# Altium schematic sheet OZ440-SE100-CAR002-SCH01_logique - Copie.SchDoc: Carte Driver Moteur sur Bus CAN
size A3; Date: 08/04/14; CheckedBy: GS; Author: BM; DocumentNumber: OZ440-SE100-CAR001-SCH01; Revision: A; SheetNumber: 1; SheetTotal: 2
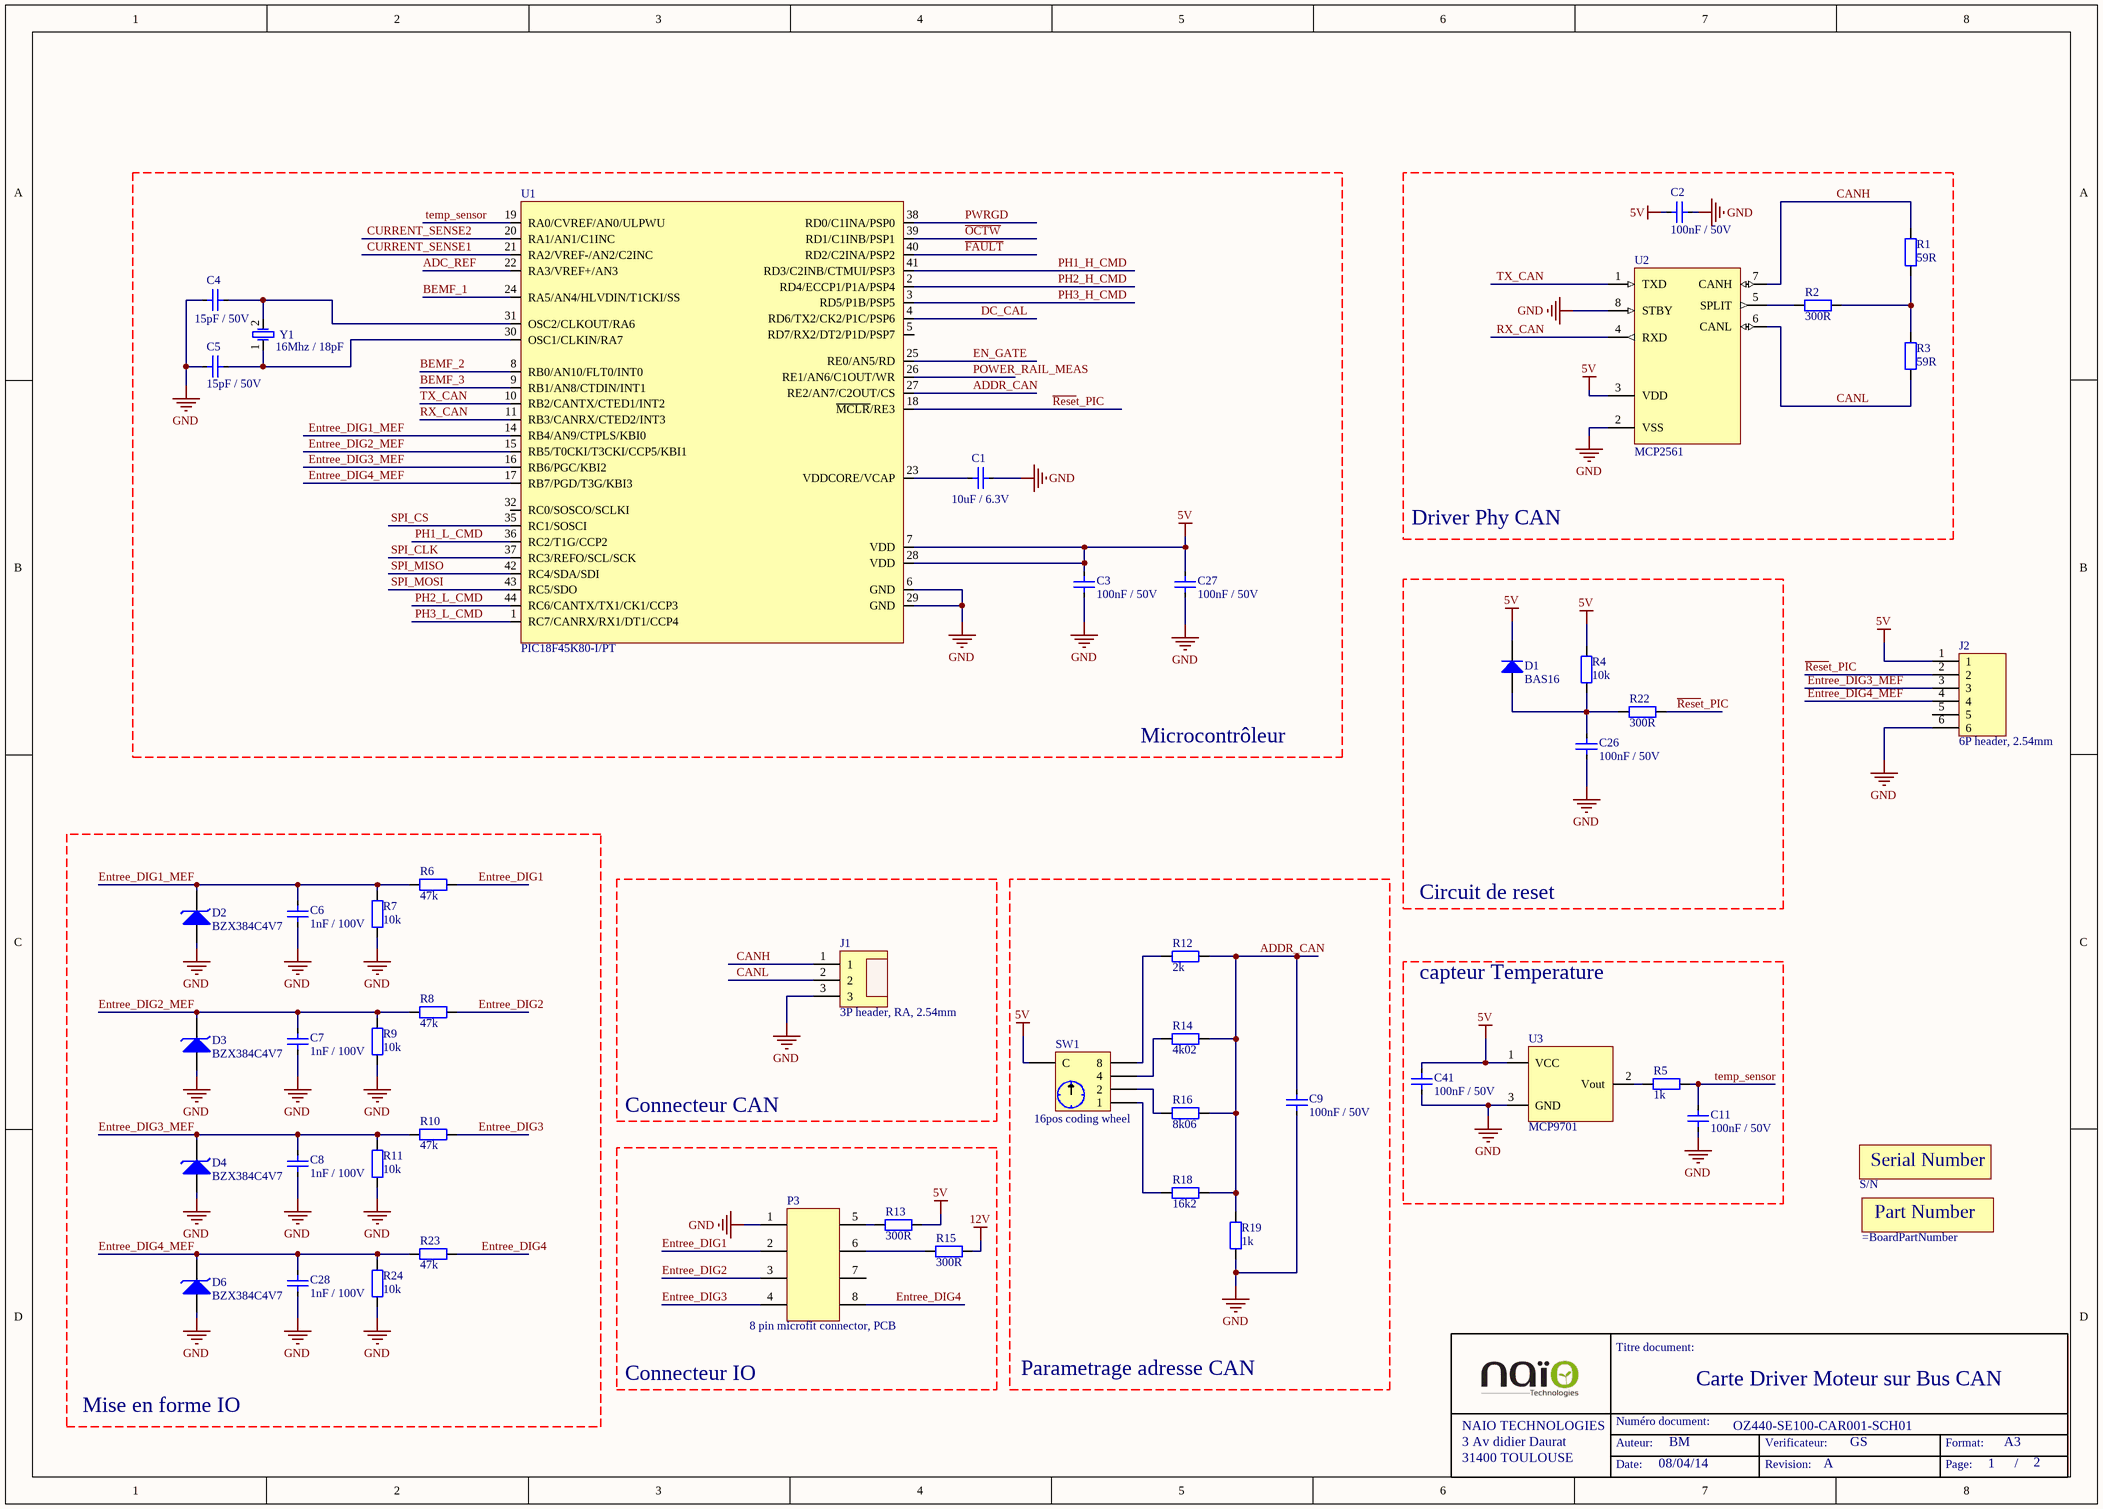
[diagram p0: OZ440-SE100-CAR002-SCH01_logique - Copie.SchDoc]

## Parts
C1  Displayed reference: 10uF / 6.3V  [C0805-STD]  (hidden comment: CAP-SMD)
C2  Displayed reference: 100nF / 50V  [C0805-STD]  (hidden comment: CAP-SMD)
C3  Displayed reference: 100nF / 50V  [C0805-STD]  (hidden comment: CAP-SMD)
C4  Displayed reference: 15pF / 50V  [C0805-STD]  (hidden comment: CAP-SMD)
C5  Displayed reference: 15pF / 50V  [C0805-STD]  (hidden comment: CAP-SMD)
C6  Displayed reference: 1nF / 100V  [C0805-STD]  (hidden comment: CAP-SMD)
C7  Displayed reference: 1nF / 100V  [C0805-STD]  (hidden comment: CAP-SMD)
C8  Displayed reference: 1nF / 100V  [C0805-STD]  (hidden comment: CAP-SMD)
C9  Displayed reference: 100nF / 50V  [C0805-STD]  (hidden comment: CAP-SMD)
C11  Displayed reference: 100nF / 50V  [C0805-STD]  (hidden comment: CAP-SMD)
C26  Displayed reference: 100nF / 50V  [C0805-STD]  (hidden comment: CAP-SMD)
C27  Displayed reference: 100nF / 50V  [C0805-STD]  (hidden comment: CAP-SMD)
C28  Displayed reference: 1nF / 100V  [C0805-STD]  (hidden comment: CAP-SMD)
C41  Displayed reference: 100nF / 50V  [C0805-STD]  (hidden comment: CAP-SMD)
D1  Displayed reference: BAS16  [SOT23-STD]  (hidden comment: BAS16-SOT23)
D2  Displayed reference: BZX384C4V7  [SOD323-SPE-BZX384]  (hidden comment: DIODE_ZENER-SOD323)
D3  Displayed reference: BZX384C4V7  [SOD323-SPE-BZX384]  (hidden comment: DIODE_ZENER-SOD323)
D4  Displayed reference: BZX384C4V7  [SOD323-SPE-BZX384]  (hidden comment: DIODE_ZENER-SOD323)
D6  Displayed reference: BZX384C4V7  [SOD323-SPE-BZX384]  (hidden comment: DIODE_ZENER-SOD323)
J1  Displayed reference: 3P header, RA, 2.54mm  [CONN-SPE_MOLEX_0015913033]  (hidden comment: CONN-STD-3P_1ROW)
J2  Displayed reference: 6P header, 2.54mm  [6P_HEADER-STD_TH_1ROW]  (hidden comment: CONN-STD-6P_1ROW)
P3  Displayed reference: 8 pin microfit connector, PCB  [CONN-SPE_MOLEX_43045-0801]  (hidden comment: CONN-SPE-8P_MOLEX_43045-0801)
PN1  PART-NUMBER  [PART_NUMBER-STD]  (value not drawn)
R1  Displayed reference: 59R  [R0805-STD]  (hidden comment: RES-SMD)
R2  Displayed reference: 300R  [R0805-STD]  (hidden comment: RES-SMD)
R3  Displayed reference: 59R  [R0805-STD]  (hidden comment: RES-SMD)
R4  Displayed reference: 10k  [R0805-STD]  (hidden comment: RES-SMD)
R5  Displayed reference: 1k  [R0805-STD]  (hidden comment: RES-SMD)
R6  Displayed reference: 47k  [R0805-STD]  (hidden comment: RES-SMD)
R7  Displayed reference: 10k  [R0805-STD]  (hidden comment: RES-SMD)
R8  Displayed reference: 47k  [R0805-STD]  (hidden comment: RES-SMD)
R9  Displayed reference: 10k  [R0805-STD]  (hidden comment: RES-SMD)
R10  Displayed reference: 47k  [R0805-STD]  (hidden comment: RES-SMD)
R11  Displayed reference: 10k  [R0805-STD]  (hidden comment: RES-SMD)
R12  Displayed reference: 2k  [R0805-STD]  (hidden comment: RES-SMD)
R13  Displayed reference: 300R  [R0805-STD]  (hidden comment: RES-SMD)
R14  Displayed reference: 4k02  [R0805-STD]  (hidden comment: RES-SMD)
R15  Displayed reference: 300R  [R0805-STD]  (hidden comment: RES-SMD)
R16  Displayed reference: 8k06  [R0805-STD]  (hidden comment: RES-SMD)
R18  Displayed reference: 16k2  [R0805-STD]  (hidden comment: RES-SMD)
R19  Displayed reference: 1k  [R0805-STD]  (hidden comment: RES-SMD)
R22  Displayed reference: 300R  [R0805-STD]  (hidden comment: RES-SMD)
R23  Displayed reference: 47k  [R0805-STD]  (hidden comment: RES-SMD)
R24  Displayed reference: 10k  [R0805-STD]  (hidden comment: RES-SMD)
SN1  Displayed reference: S/N  [SERIAL_NUMBER-STD]  (hidden comment: SERIAL-NUMBER)
SW1  Displayed reference: 16pos coding wheel  [SW-SPE-CTS_220-AMA16]  (hidden comment: Switch-STD-coding_wheel)
U1  Displayed reference: PIC18F45K80-I/PT  [TQFP44-SPE-PIC18F45k80]  (hidden comment: P18F45K80-TQFP44)
U2  Displayed reference: MCP2561  [SO8-SPE-MCP2561]  (hidden comment: MCP2561-SOIC08)
U3  Displayed reference: MCP9701  [SOT23-STD]  (hidden comment: MCP97XX-SOT23)
Y1  Displayed reference: 16Mhz / 18pF  [XTAL-SPE-HC49_SMD]  (hidden comment: XTAL-SMD)

## Nets
5V: C2.2 C3.2 C27.2 C41.2 D1.3(K) J2.1 R4.2 R13.2 SW1.C U1.7(VDD) U1.28(VDD) U2.3(VDD) U3.1(VCC)
12V: R15.2
GND: C1.2 C2.1 C3.1 C4.1 C5.1 C6.1 C7.1 C8.1 C9.1 C11.1 C26.1 C27.1 C28.1 C41.1 D2.A D3.A D4.A D6.A J1.3 J2.6 P3.1 R7.1 R9.1 R11.1 R19.1 R24.1 U1.6(GND) U1.29(GND) U2.2(VSS) U2.8(STBY) U3.3(GND)
~{FAULT}: U1.40(RD2/C2INA/PSP2)
~{OCTW}: U1.39(RD1/C1INB/PSP1)
~{Rese}t_PIC: J2.2 R22.2 U1.18(~{MCLR}/RE3)
ADC_REF: U1.22(RA3/VREF+/AN3)
ADDR_CAN: C9.2 R12.2 R14.2 R16.2 R18.2 R19.2 U1.27(RE2/AN7/C2OUT/CS)
BEMF_1: U1.24(RA5/AN4/HLVDIN/T1CKI/SS)
BEMF_2: U1.8(RB0/AN10/FLT0/INT0)
BEMF_3: U1.9(RB1/AN8/CTDIN/INT1)
CANH: J1.1 R1.2 U2.7(CANH)
CANL: J1.2 R3.1 U2.6(CANL)
CURRENT_SENSE1: U1.21(RA2/VREF-/AN2/C2INC)
CURRENT_SENSE2: U1.20(RA1/AN1/C1INC)
DC_CAL: U1.4(RD6/TX2/CK2/P1C/PSP6)
EN_GATE: U1.25(RE0/AN5/RD)
Entree_DIG1: P3.2 R6.1
Entree_DIG1_MEF: C6.2 D2.K R6.2 R7.2 U1.14(RB4/AN9/CTPLS/KBI0)
Entree_DIG2: P3.3 R8.1
Entree_DIG2_MEF: C7.2 D3.K R8.2 R9.2 U1.15(RB5/T0CKI/T3CKI/CCP5/KBI1)
Entree_DIG3: P3.4 R10.1
Entree_DIG3_MEF: C8.2 D4.K J2.3 R10.2 R11.2 U1.16(RB6/PGC/KBI2)
Entree_DIG4: P3.8 R23.1
Entree_DIG4_MEF: C28.2 D6.K J2.4 R23.2 R24.2 U1.17(RB7/PGD/T3G/KBI3)
PH1_H_CMD: U1.41(RD3/C2INB/CTMUI/PSP3)
PH1_L_CMD: U1.36(RC2/T1G/CCP2)
PH2_H_CMD: U1.2(RD4/ECCP1/P1A/PSP4)
PH2_L_CMD: U1.44(RC6/CANTX/TX1/CK1/CCP3)
PH3_H_CMD: U1.3(RD5/P1B/PSP5)
PH3_L_CMD: U1.1(RC7/CANRX/RX1/DT1/CCP4)
POWER_RAIL_MEAS: U1.26(RE1/AN6/C1OUT/WR)
PWRGD: U1.38(RD0/C1INA/PSP0)
RX_CAN: U1.11(RB3/CANRX/CTED2/INT3) U2.4(RXD)
SPI_CLK: U1.37(RC3/REFO/SCL/SCK)
SPI_CS: U1.35(RC1/SOSCI)
SPI_MISO: U1.42(RC4/SDA/SDI)
SPI_MOSI: U1.43(RC5/SDO)
temp_sensor: C11.2 R5.2 U1.19(RA0/CVREF/AN0/ULPWU)
TX_CAN: U1.10(RB2/CANTX/CTED1/INT2) U2.1(TXD)
NetC1_1: C1.1 U1.23(VDDCORE/VCAP)
NetC4_2: C4.2 U1.31(OSC2/CLKOUT/RA6) Y1.2(OSC2)
NetC5_2: C5.2 U1.30(OSC1/CLKIN/RA7) Y1.1(OSC1)
NetC26_2: C26.2 D1.1(A) R4.1 R22.1
NetP3_5: P3.5 R13.1
NetP3_6: P3.6 R15.1
NetR1_1: R1.1 R2.2 R3.2
NetR2_1: R2.1 U2.5(SPLIT)
NetR5_1: R5.1 U3.2(Vout)
NetR12_1: R12.1 SW1.8
NetR14_1: R14.1 SW1.4
NetR16_1: R16.1 SW1.2
NetR18_1: R18.1 SW1.1

Not connected (* = marked no-connect by the designer): J2 5; P3 7; U1 5(RD7/RX2/DT2/P1D/PSP7) 32(RC0/SOSCO/SCLKI)

## Notes on the sheet
- Driver Phy CAN
- Microcontrôleur
- Circuit de reset
- capteur Temperature
- Connecteur CAN
- Connecteur IO
- Parametrage adresse CAN
- Mise en forme IO
- Titre document:
- NAIO TECHNOLOGIES
- 3 Av didier Daurat
- 31400 TOULOUSE
- Auteur:
- Numéro document:
- Verificateur:
- Format:
- A3
- Date:
- Revision:
- Page:
- /
- (in symbol Large part number) Part Number

## Library data of the parts
C1 = C0805C106K9PACxx: 0805 10uF / 6.3V X5R ceramic capacitor; Manufacturer: Kemet; Max Voltage: 6.3; Tolerance: +/- 10%; Validated: N; Reference: C0805C106K9PACxx; Value: 10uF; Material: X5R; Footprint description: standard Capacitor 0805; Pin Count: 2; helpURL: http://www.farnell.com/datasheets/40863.pdf; Supplier 1: Farnell; Supplier Part Number 1: 1643357; Supplier 2: Digi-Key; Supplier Part Number 2: 399-3138-1-ND
C2 C3 C9 C11 C26 C27 C41 = VJ0805Y104KXAxx: 0805 100nF / 50V  X7R ceramic capacitor; Manufacturer: vishay; Max Voltage: 50; Tolerance: +/- 10%; Validated: N; Reference: VJ0805Y104KXAxx; Value: 100nF; Material: X7R; Footprint description: standard Capacitor 0805; Pin Count: 2; helpURL: http://www.vishay.com/docs/45200/highrels.pdf; Supplier 1: Farnell; Supplier Part Number 1: 1612208; Supplier 2: Digi-Key; Supplier Part Number 2: 720-1266-6-ND
C4 C5 = C0805C150J5GACxx: 0805 15pF / 50V COG ceramic capacitor; Manufacturer: Kemet; Max Voltage: 50; Tolerance: +/- 5%; Validated: N; Reference: C0805C150J5GACxx; Value: 15pF; Material: COG; Footprint description: standard Capacitor 0805; Pin Count: 2; helpURL: http://www.farnell.com/datasheets/40863.pdf; Supplier 1: Farnell; Supplier Part Number 1: 1650868; Supplier 2: Digi-Key; Supplier Part Number 2: 399-1111-1-ND
C6-C8 C28 = VJ0805Y102KXBxx: 0805 1nF / 100V X7R ceramic capacitor; Manufacturer: vishay; Max Voltage: 50; Tolerance: +/- 10%; Validated: N; Reference: VJ0805Y102KXBxx; Value: 1nF; Material: X7R; Footprint description: standard Capacitor 0805; Pin Count: 2; helpURL: http://www.vishay.com/docs/45200/highrels.pdf; Supplier 1: Farnell; Supplier Part Number 1: 1555112; Supplier 2: Digi-Key; Supplier Part Number 2: 720-1264-1-ND
D1 = BAS16: 100V / 120mA signal  diode; Manufacturer: NXP; Max Voltage: 100; Max Current: 0.2A; Validated: False; Reference: BAS16; component type: DIODE; Footprint description: Sot23 SMD package; Pin Count: 3; Rev: 2010; helpURL: http://www.nxp.com/documents/data_sheet/BAS16_SER.pdf; Supplier 1: Farnell; Supplier Part Number 1: 1081180; Supplier 2: Digi-Key; Supplier Part Number 2: 568-1596-1-ND
D2-D4 D6 = BZX384C4V7: 4.7V zener diode; Manufacturer: VISHAY; Rated Power: 200mW; Validated: FALSE; Reference: BZX384C4V7; component type: Zener diode; Value: 4.7V; Footprint description: SOD323; Pin Count: 2; Rev: 1.9; helpURL: http://www.vishay.com/docs/85764/bzx384.pdf; Supplier 1: Mouser; Supplier Part Number 1: 771-BZX384-C4V7115; Supplier 2: Farnell; Supplier Part Number 2: 8735700
J1 = 0015913033: 3 pin , 2.54mm SMD header; Manufacturer: Molex; Validated: False; Reference: 0015913033; Footprint description: 3P header, RA, 2.54mm; Pin Count: 3; Rev: G; helpURL: http://www.molex.com/pdm_docs/sd/015913033_sd.pdf; Supplier 1: Mouser; Supplier Part Number 1: 538-15-91-3033; Supplier 2: Digi-Key; Supplier Part Number 2: 0015913033-ND
J2 = 68000-406HLF: 6P, 1 row, 2.54mm header; Manufacturer: FCI; Validated: False; Reference: 68000-406HLF; Footprint description: TH, 6 pin, 2.54mm; Pin Count: 6; Rev: DB; helpURL: http://portal.fciconnect.com/Comergent//fci/drawing/68000.pdf
P3 = 43045-0801: 8 pin Microfit connector; Manufacturer: Molex; Max Voltage: 600V; Max Current: 5A; Validated: False; Reference: 43045-0801; Footprint description: 8 pin SMT connector RA, TH; Pin Count: 8; Rev: F; helpURL: http://www.molex.com/pdm_docs/sd/430450801_sd.pdf; Supplier 1: Mouser; Supplier Part Number 1: 538-43045-0801; Supplier 2: Digi-Key; Supplier Part Number 2: WM3253-ND
PN1 = Large part number: large part number copper identification; Validated: False; Reference: Large part number; Displayed reference: =BoardPartNumber
R1 R3 = CRCW080559R0FKxx: 59 Ohm 0805 SMD resistor; Manufacturer: Vishay; Value: 59; Tolerance: 1 %; Rated Power: 0.125 W; Validated: No; Reference: CRCW080559R0FKxx; Footprint description: standard 0805 SMD; Pin Count: 2; helpURL: http://www.vishay.com/docs/20035/dcrcwe3.pdf; Supplier 1: Mouser; Supplier Part Number 1: 71-CRCW080559R0FKEA; Supplier 2: Farnell; Supplier Part Number 2: 2138817
R2 R13 R15 R22 = CRCW0805300RFKxx: 300 ohm 0805 SMD resistor; Manufacturer: Vishay; Value: 300; Tolerance: 1%; Rated Power: 0.125W; Validated: No; Reference: CRCW0805300RFKxx; Footprint description: standard 0805 SMD; Pin Count: 2; helpURL: http://www.vishay.com/docs/20035/dcrcwe3.pdf; Supplier 1: Mouser; Supplier Part Number 1: 71-CRCW0805300RFKEA; Supplier 2: Farnell; Supplier Part Number 2: 1152346
R4 R7 R9 R11 R24 = CRCW080510K0FKxx: 10k Ohm 0805 SMD resistor; Manufacturer: Vishay; Value: 10 000; Tolerance: 1 %; Rated Power: 0,125 W; Validated: No; Reference: CRCW080510K0FKxx; Footprint description: standard 0805 SMD; Pin Count: 2; helpURL: http://www.vishay.com/docs/20035/dcrcwe3.pdf; Supplier 1: Farnell; Supplier Part Number 1: 1469856; Supplier 2: Mouser; Supplier Part Number 2: 71-CRCW0805-10K-E3
R5 R19 = CRCW08051K00FKxx: 1k Ohm 0805 SMD resistor; Manufacturer: Vishay; Value: 1 000; Tolerance: 1 %; Rated Power: 0,125 W; Validated: No; Reference: CRCW08051K00FKxx; Footprint description: standard 0805 SMD; Pin Count: 2; helpURL: http://www.vishay.com/docs/20035/dcrcwe3.pdf; Supplier 1: Farnell; Supplier Part Number 1: 1469847; Supplier 2: Mouser; Supplier Part Number 2: 71-CRCW0805-1.0K-E3
R6 R8 R10 R23 = CRCW080547K0FKxx: 47k Ohm 0805 SMD resistor; Manufacturer: Vishay; Value: 47 000; Tolerance: 1 %; Rated Power: 0,125 W; Validated: No; Reference: CRCW080547K0FKxx; Footprint description: standard 0805 SMD; Pin Count: 2; helpURL: http://www.vishay.com/docs/20035/dcrcwe3.pdf; Supplier 1: Farnell; Supplier Part Number 1: 1469929; Supplier 2: Mouser; Supplier Part Number 2: 71-CRCW0805-47K-E3
R12 = CRCW08052K00FKxx: 2k Ohm 0805 SMD resistor; Manufacturer: Vishay; Value: 2 000; Tolerance: 1%; Rated Power: 0.125W; Validated: No; Reference: CRCW08052K00FKxx; Footprint description: standard 0805 SMD; Pin Count: 2; helpURL: http://www.vishay.com/docs/20035/dcrcwe3.pdf; Supplier 1: Mouser; Supplier Part Number 1: 71-CRCW08052K00FKEB; Supplier 2: Farnell; Supplier Part Number 2: 1469884
R14 = CRCW08054K02FKxx: 4k02 Ohm 0805 SMD resistor; Manufacturer: Vishay; Value: 4 020; Tolerance: 1%; Rated Power: 0.125W; Validated: No; Reference: CRCW08054K02FKxx; Footprint description: standard 0805 SMD; Pin Count: 2; helpURL: http://www.vishay.com/docs/20035/dcrcwe3.pdf; Supplier 1: Farnell; Supplier Part Number 1: 1469920; Supplier 2: Mouser; Supplier Part Number 2: 71-CRCW0805-4.02K-E3
R16 = CRCW08058K06FKxx: 8k06 Ohm 0805 SMD resistor; Manufacturer: Vishay; Value: 8 060; Tolerance: 1%; Rated Power: 0.125W; Validated: No; Reference: CRCW08058K06FKxx; Footprint description: standard 0805 SMD; Pin Count: 2; helpURL: http://www.vishay.com/docs/20035/dcrcwe3.pdf; Supplier 1: Farnell; Supplier Part Number 1: 1653038; Supplier 2: Mouser; Supplier Part Number 2: 71-CRCW0805-8.06K-E3
R18 = CRCW080516K2FKxx: 16k2 Ohm 0805 SMD resistor; Manufacturer: Vishay; Value: 16200; Tolerance: 1%; Rated Power: 0.125W; Validated: No; Reference: CRCW080516K2FKxx; Footprint description: standard 0805 SMD; Pin Count: 2; helpURL: http://www.vishay.com/docs/20035/dcrcwe3.pdf; Supplier 1: Mouser; Supplier Part Number 1: 71-CRCW0805-16.2K-E3; Supplier 2: Farnell; Supplier Part Number 2: 1469878
SN1 = Serial Number: serial number copper identification; Validated: False; Reference: Serial Number
SW1 = 220AMA16x: 16 positions rotary dip switch; Manufacturer: CTS; Validated: False; Reference: 220AMA16x; Footprint description: 10x10mm SMD; Pin Count: 6; Rev: 20/02/14; helpURL: http://www.ctscorp.com/components/Datasheets/220.pdf; Supplier 1: Mouser; Supplier Part Number 1: 774-220AMA16R; Supplier 2: Digi-Key; Supplier Part Number 2: CT3072-6-ND
U1 = PIC18F45K80-I/PT: Pic microcontroller with embeded CAN controller; Manufacturer: MICROCHIP; Validated: False; Reference: PIC18F45K80-I/PT; Footprint description: standard TQFP 44 pin; Pin Count: 44; Rev: F; helpURL: http://ww1.microchip.com/downloads/en/DeviceDoc/39977f.pdf; Supplier 1: Farnell; Supplier Part Number 1: 1823169; Supplier 2: Mouser; Supplier Part Number 2: 579-PIC18F45K80-I/PT
U2 = MCP2561-E/SN: CAN transceiver with common mode stabilisation; Manufacturer: Microchip; Max Voltage: 5.5V; Validated: False; Reference: MCP2561-E/SN; Footprint description: standard SO8; Pin Count: 8; Rev: B; helpURL: http://ww1.microchip.com/downloads/en/DeviceDoc/25167B.pdf; Supplier 1: Farnell; Supplier Part Number 1: 2362837; Supplier 2: Mouser; Supplier Part Number 2: 579-MCP2561-E/SN
U3 = MCP9701AT-E/TT: temperature sensor with voltage output; Manufacturer: Microchip; Max Voltage: 5.5V; Reference: MCP9701AT-E/TT; Footprint description: SOT23; Pin Count: 3; Rev: E; helpURL: http://ww1.microchip.com/downloads/en/DeviceDoc/21942e.pdf; Supplier 1: Mouser; Supplier Part Number 1: 579-MCP9701AT-E/TT; Supplier 2: Farnell; Supplier Part Number 2: 1834864
Y1 = MCRSD16000F183000RR: 16Mhz Crystal; Manufacturer: Multicomp; Value: 16 000; Validated: False; Reference: MCRSD16000F183000RR; Footprint description: HC49 /US SMD; Pin Count: 2; Frequency band: 16Mhz; Rev: 1.0; helpURL: http://www.farnell.com/datasheets/1801275.pdf; Supplier 1: Farnell; Supplier Part Number 1: 2395958